# Altium schematic sheet Top_Level.SchDoc
size A; SheetNumber: 1; SheetTotal: 4
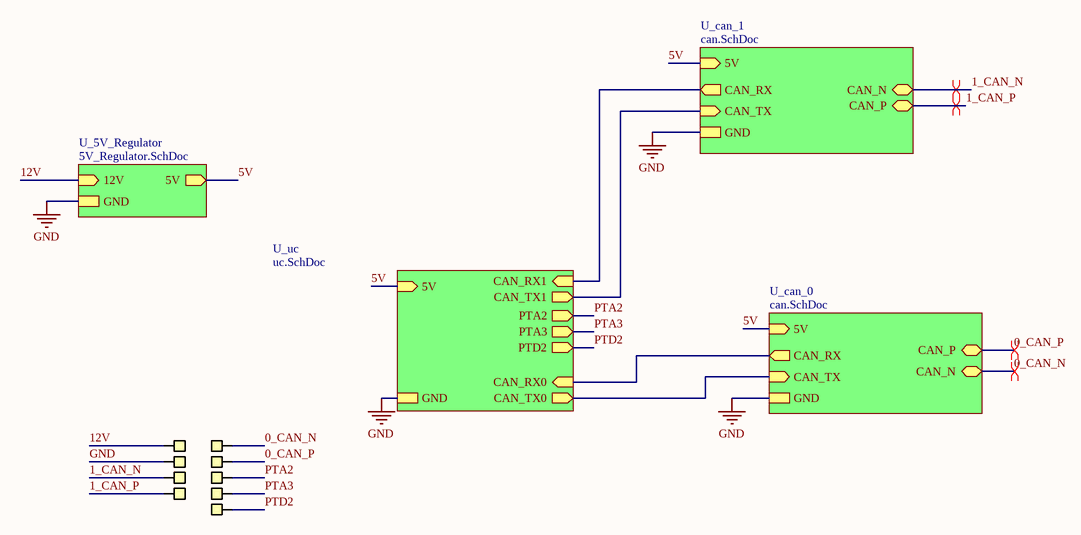
[diagram p0: Top_Level.SchDoc]

## Parts
X1  GenericPinHeader(0.1in)  [GenericPinHeader(.1in)]  (value not drawn)
X2  GenericPinHeader(0.1in)  [GenericPinHeader(.1in)]  (value not drawn)
X3  GenericPinHeader(0.1in)  [GenericPinHeader(.1in)]  (value not drawn)
X4  GenericPinHeader(0.1in)  [GenericPinHeader(.1in)]  (value not drawn)
X5  GenericPinHeader(0.1in)  [GenericPinHeader(.1in)]  (value not drawn)
X6  GenericPinHeader(0.1in)  [GenericPinHeader(.1in)]  (value not drawn)
X7  GenericPinHeader(0.1in)  [GenericPinHeader(.1in)]  (value not drawn)
X8  GenericPinHeader(0.1in)  [GenericPinHeader(.1in)]  (value not drawn)
X9  GenericPinHeader(0.1in)  [GenericPinHeader(.1in)]  (value not drawn)

## Sub-sheets
U_5V_Regulator = 5V_Regulator.SchDoc: 5V (out), 12V (in), GND
U_can_0 = can.SchDoc: 5V (in), CAN_P (bidir), CAN_N (bidir), CAN_TX (in), CAN_RX (out), GND
U_can_1 = can.SchDoc: 5V (in), CAN_P (bidir), CAN_N (bidir), CAN_TX (in), CAN_RX (out), GND
U_uc = uc.SchDoc: 5V (in), CAN_TX1 (out), CAN_RX1 (in), CAN_TX0 (out), CAN_RX0 (in), PTA2 (out), PTA3 (out), PTD2 (out), GND

## Nets
GND: X3.1(Pin) ; sheet U_5V_Regulator/GND, sheet U_can_1/GND, sheet U_uc/GND, sheet U_can_0/GND
0_CAN_N: X2.1(Pin) ; sheet U_can_0/CAN_N
0_CAN_P: X4.1(Pin) ; sheet U_can_0/CAN_P
1_CAN_N: X5.1(Pin) ; sheet U_can_1/CAN_N
1_CAN_P: X7.1(Pin) ; sheet U_can_1/CAN_P
5V: sheet U_5V_Regulator/5V, sheet U_can_1/5V, sheet U_uc/5V, sheet U_can_0/5V
12V: X1.1(Pin) ; sheet U_5V_Regulator/12V
PTA2: X6.1(Pin) ; sheet U_uc/PTA2
PTA3: X8.1(Pin) ; sheet U_uc/PTA3
PTD2: X9.1(Pin) ; sheet U_uc/PTD2
(unnamed): sheet U_can_1/CAN_TX, sheet U_uc/CAN_TX1
(unnamed): sheet U_can_1/CAN_RX, sheet U_uc/CAN_RX1
(unnamed): sheet U_uc/CAN_TX0, sheet U_can_0/CAN_TX
(unnamed): sheet U_uc/CAN_RX0, sheet U_can_0/CAN_RX

## Layout directives
differential pair: 0_CAN_N, 0_CAN_P, 1_CAN_N, 1_CAN_P

## Library data of the parts
X1-X9 = GenericPinHeader(0.1in): Generic .1in(2.54mm) pitch pin header